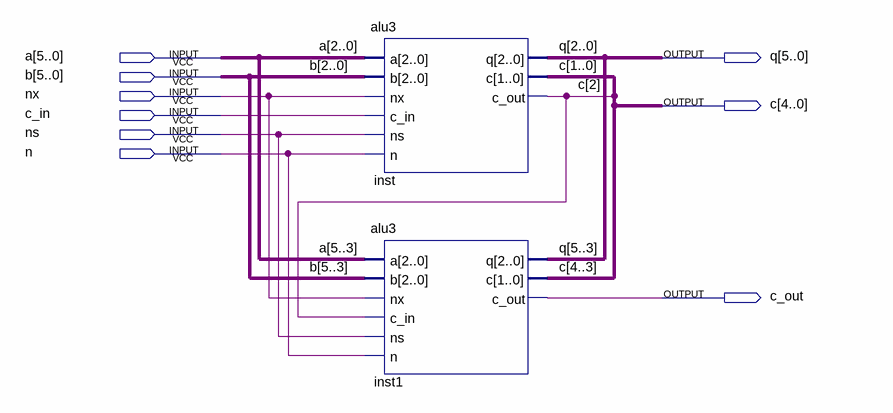
[diagram p0: schematic sheet]
// Quartus schematic alu6.bdf as structural Verilog: 2 symbols, 9 pins
module alu6 (
  input  [5:0] a,
  input  [5:0] b,
  input  nx,
  input  c_in,
  input  ns,
  input  n,
  output [5:0] q,
  output [4:0] c,
  output c_out
);

  alu3 inst (.a(a[2:0]), .b(b[2:0]), .nx(nx), .c_in(c_in), .ns(ns), .n(n), .q(q[2:0]), .c(c[1:0]), .c_out(c[2]));
  alu3 inst1 (.a(a[5:3]), .b(b[5:3]), .nx(nx), .c_in(c[2]), .ns(ns), .n(n), .q(q[5:3]), .c(c[4:3]), .c_out(c_out));
endmodule
